# EAGLE schematic diplexer_v4rev0-schematic (EAGLE 7.2.0)
sdf
DRAWING_AUTHOR: Lambert Le
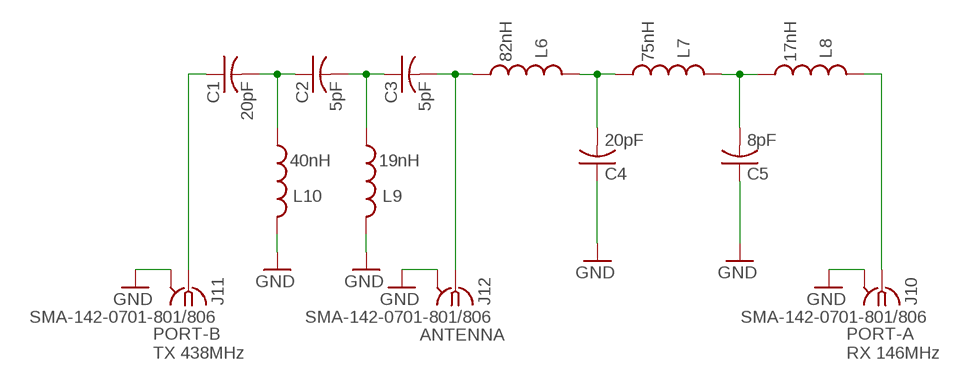
[diagram p0: schematic, sheet 1]

## Parts
C1  20pF  C-USC1608  [C1608]
C2  5pF  C-USC2012  [C2012]
C3  5pF  C-USC2012  [C2012]
C4  20pF  C-USC1608  [C1608]
C5  8pF  C-USC2012  [C2012]
J10  SMA-142-0701-801/806  [J502-ND-142-0701-801/806]
J11  SMA-142-0701-801/806  [J502-ND-142-0701-801/806]
J12  SMA-142-0701-801/806  [J502-ND-142-0701-801/806]
L6  82nH  L-US  [L01005]
L7  75nH  L-US  [L01005]
L8  17nH  L-US  [L01005]
L9  19nH  L-US  [L01005]
L10  40nH  L-US  [L01005]

## Nets
GND: C4.1 C5.1 J10.G@1(GND) J11.G@1(GND) J12.G@1(GND) L9.2 L10.2
N$2: J10.1 L8.2
N$3: C5.2 L7.2 L8.1
N$4: C4.2 L6.2 L7.1
N$5: C1.1 J11.1
N$6: C3.2 J12.1 L6.1
N$7: C2.2 C3.1 L9.1
N$8: C1.2 C2.1 L10.1

## Notes on the sheet
- ANTENNA
- PORT-B
  TX 438MHz
- PORT-A
  RX 146MHz

## Power pins joined to a net without a drawn wire
GND: J10.G@2(GND) J10.G@3(GND) J10.G@4(GND) J11.G@2(GND) J11.G@3(GND) J11.G@4(GND) J12.G@2(GND) J12.G@3(GND) J12.G@4(GND)

## Library data of the parts
C1-C5 = rcl:C-US: CAPACITOR, American symbol
J10-J12 = con-coax:SMA-: SMA 50 Ohm End Launch Jack Receptacle - Round Contact Johnson Components Source: www.johnsoncomponents.com .. J502-ND.pdf; MF: JOHNSON COMPONENTS; MPN: 142-0701-801; OC_FARNELL: 1608592; OC_NEWARK: 90F2624
L6-L10 = diplexer-rcl:L-US: INDUCTOR, American symbol